# Altium schematic sheet MCU_CAN.SchDoc
size C
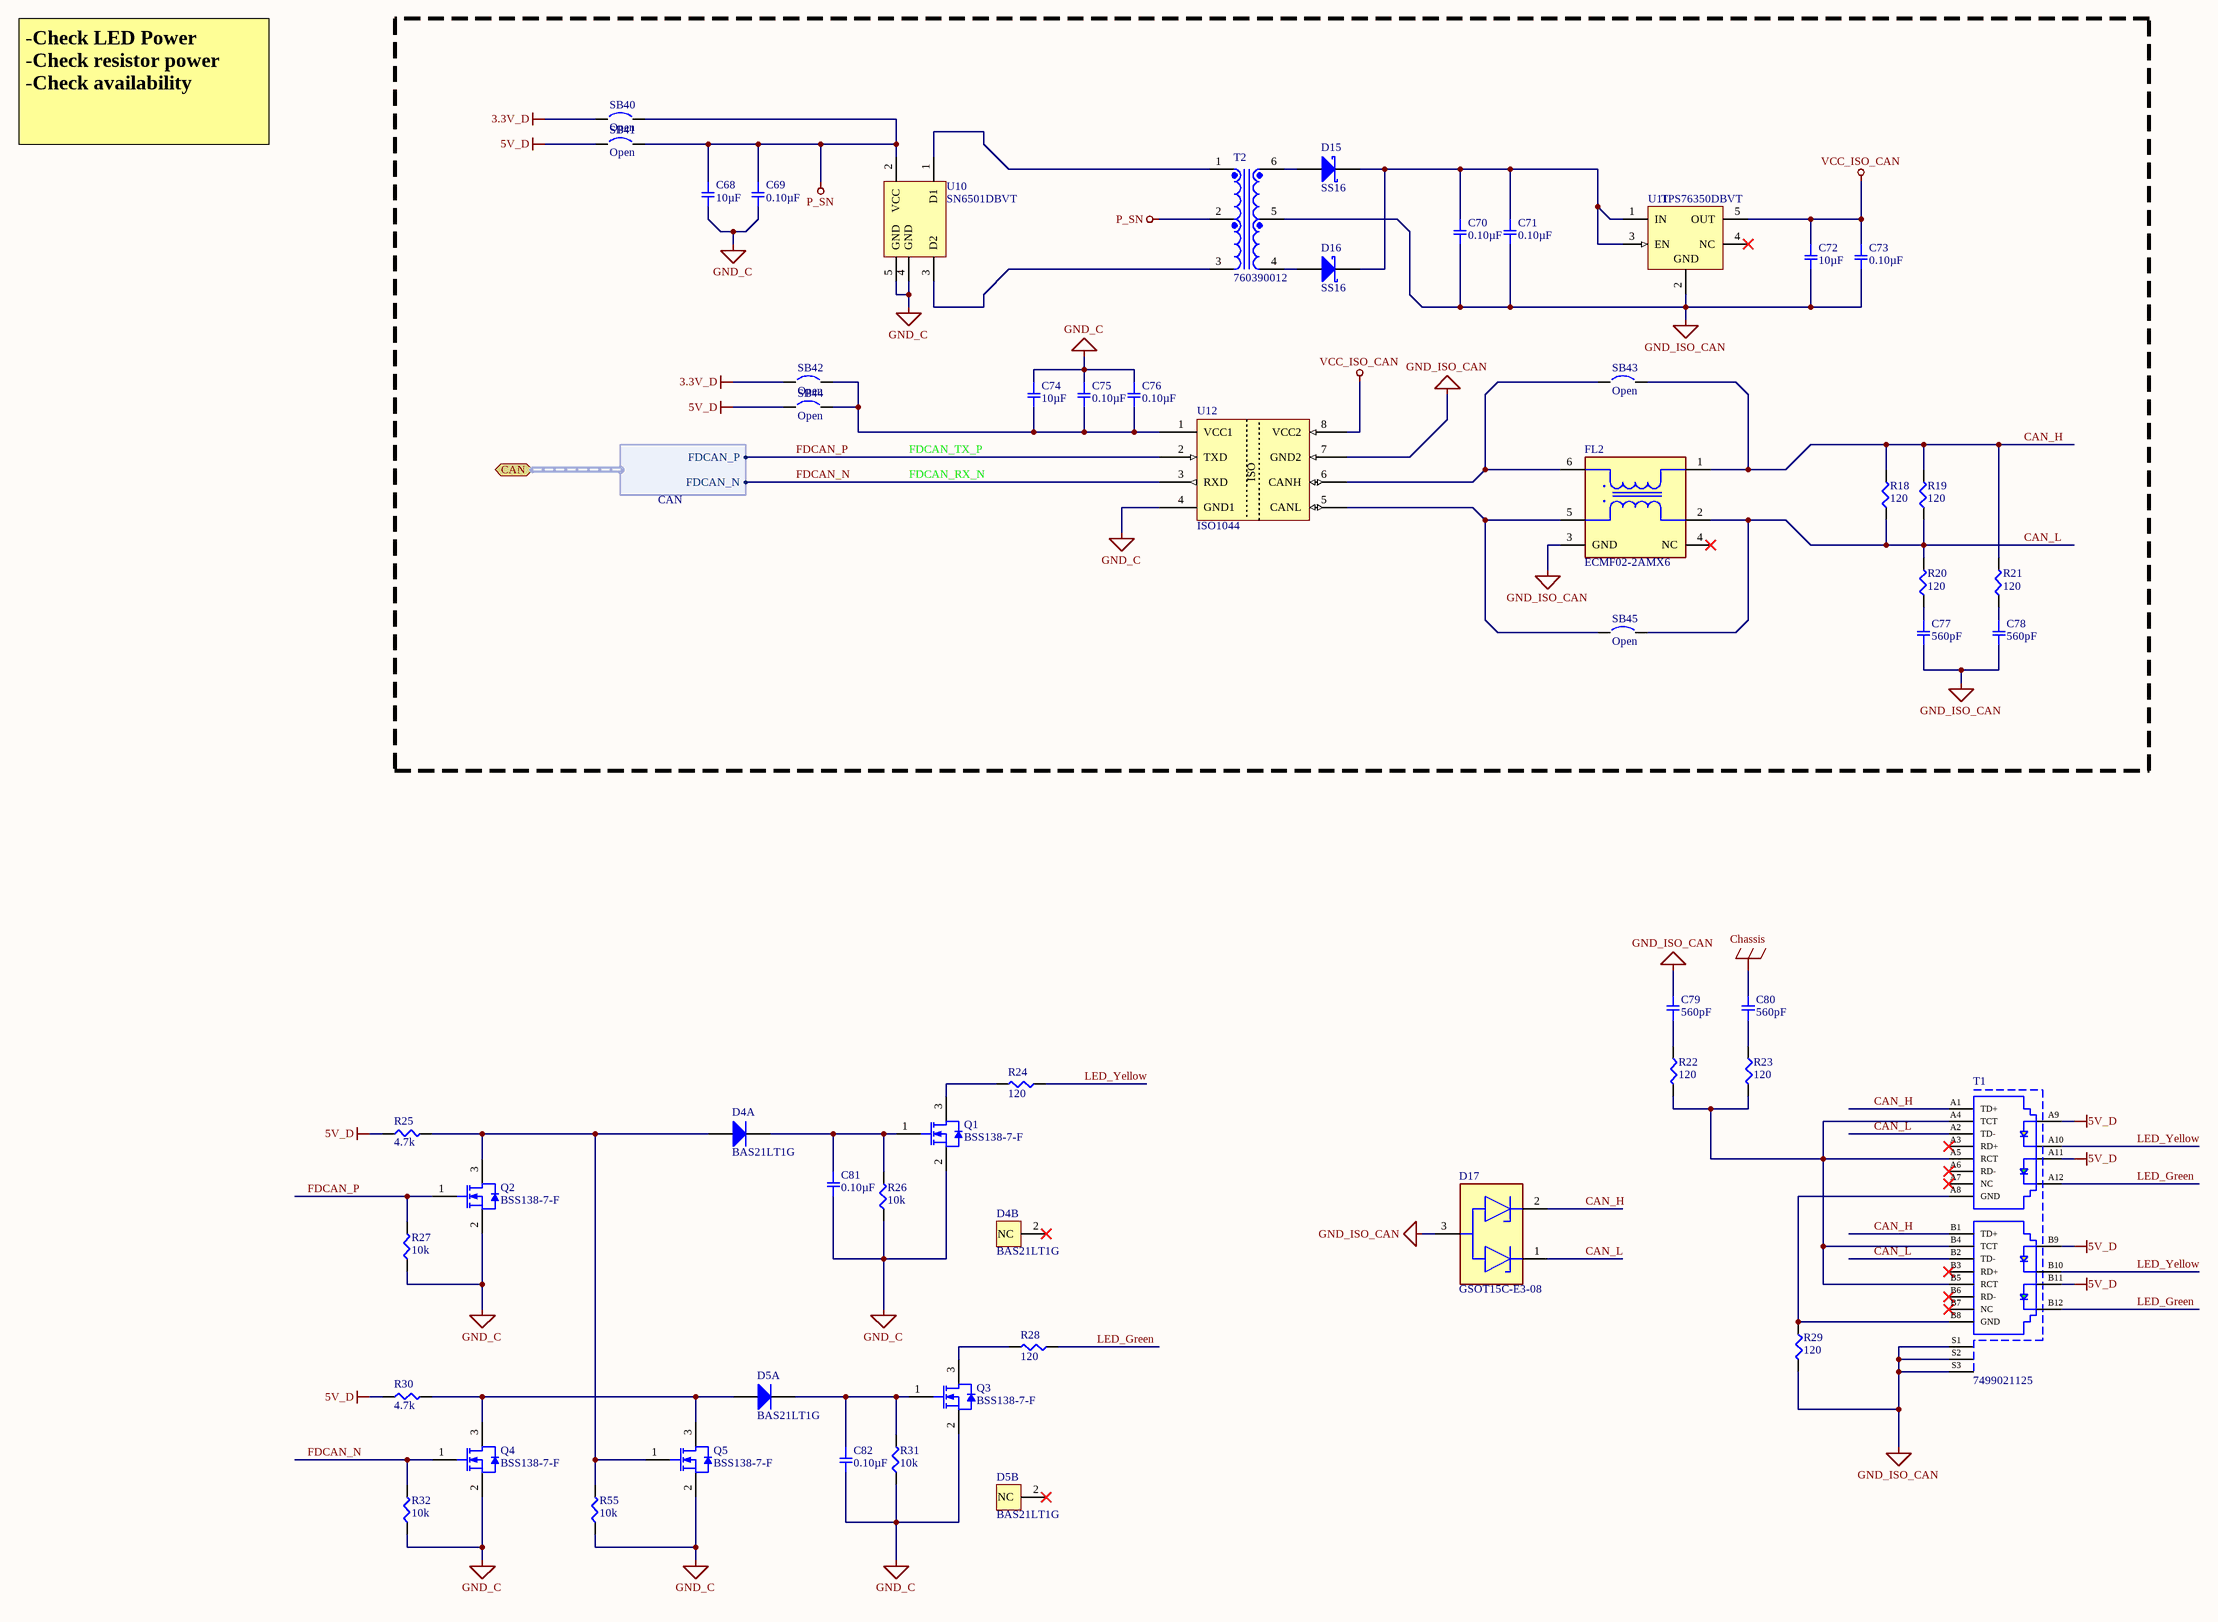
[diagram p0: MCU_CAN.SchDoc]

## Parts
C68  10µF  [SMD-0805C]
C69  0.10µF  [SMD-0805C]
C70  0.10µF  [SMD-0805C]
C71  0.10µF  [SMD-0805C]
C72  10µF  [SMD-0805C]
C73  0.10µF  [SMD-0805C]
C74  10µF  [SMD-0805C]
C75  0.10µF  [SMD-0805C]
C76  0.10µF  [SMD-0805C]
C77  560pF  [SMD-0805C]
C78  560pF  [SMD-0805C]
C79  560pF  [SMD-0805C]
C80  560pF  [SMD-0805C]
C81  0.10µF  [SMD-0805C]
C82  0.10µF  [SMD-0805C]
D4  BAS21LT1G  [ONSC-SOT-23-3-318-08_V]  (parts A,B of 2)
D5  BAS21LT1G  [ONSC-SOT-23-3-318-08_V]  (parts A,B of 2)
D15  SS16  [FAIR-SMA-2_B_V]
D16  SS16  [FAIR-SMA-2_B_V]
D17  GSOT15C-E3-08  [FP-6_541-5014_01-4-MFG]
FL2  ECMF02-2AMX6  [FP-QFN-6L-MFG]
Q1  BSS138-7-F  [DIOD-SOT23-3_V]
Q2  BSS138-7-F  [DIOD-SOT23-3_V]
Q3  BSS138-7-F  [DIOD-SOT23-3_V]
Q4  BSS138-7-F  [DIOD-SOT23-3_V]
Q5  BSS138-7-F  [DIOD-SOT23-3_V]
R18  120  [SMD-0603-RES]
R19  120  [SMD-0603-RES]
R20  120  [SMD-0603-RES]
R21  120  [SMD-0603-RES]
R22  120  [SMD-0603-RES]
R23  120  [SMD-0603-RES]
R24  120  [SMD-0603-RES]
R25  4.7k  [SMD-0603-RES]
R26  10k  [SMD-0603-RES]
R27  10k  [SMD-0603-RES]
R28  120  [SMD-0603-RES]
R29  120  [SMD-0603-RES]
R30  4.7k  [SMD-0603-RES]
R31  10k  [SMD-0603-RES]
R32  10k  [SMD-0603-RES]
R55  10k  [SMD-0603-RES]
SB40  Open  [SB_0603]  (no BOM)
SB41  Open  [SB_0603]  (no BOM)
SB42  Open  [SB_0603]  (no BOM)
SB43  Open  [SB_0603]  (no BOM)
SB44  Open  [SB_0603]  (no BOM)
SB45  Open  [SB_0603]  (no BOM)
T1  7499021125  [7499021125]
T2  760390012  [WE-760390012-6_V]
U10  SN6501DBVT  [SOT95P278X110-5N]
U11  TPS76350DBVT  [DBV0005A_M]
U12  ISO1044  [SOIC127P570X175_HS-9N - No Thermal]

## Ports
CAN (bidir, harness CAN)

## Harnesses
CAN: FDCAN_P, FDCAN_N

## Nets
3.3V_D: SB40.1 SB42.1
5V_D: R25.1 R30.1 SB41.1 SB44.1 T1.A9 T1.A11 T1.B9 T1.B11
Chassis: C80.2
GND_C: C68.2 C69.2 C74.1 C75.1 C76.1 C81.2 C82.2 Q1.2(S) Q2.2(S) Q3.2(S) Q4.2(S) Q5.2(S) R26.1 R27.1 R31.1 R32.1 R55.1 U10.4(GND) U10.5(GND) U12.4(GND1)
GND_ISO_CAN: C70.2 C71.2 C72.2 C73.2 C77.2 C78.2 C79.2 D17.3(COMMON_ANODE) FL2.3(GND) R29.2 T1.S1(Shield) T1.S2(Shield) T1.S3(Shield) T2.5 U11.2(GND) U12.7(GND2)
P_SN: C68.1 C69.1 SB40.2 SB41.2 T2.2 U10.2(VCC)
VCC_ISO_CAN: C72.1 C73.1 U11.5(OUT) U12.8(VCC2)
CAN_H: D17.2(2_CATHODE) FL2.1(D+) R18.2 R19.2 R21.2 SB43.2 T1.A1(TD+) T1.B1(TD+)
CAN_L: D17.1(1_CATHODE) FL2.2(D-) R18.1 R19.1 R20.2 SB45.2 T1.A2(TD-) T1.B2(TD-)
FDCAN_N: Q4.1(G) R32.2 U12.3(RXD) ; port CAN.FDCAN_N
FDCAN_P: Q2.1(G) R27.2 U12.2(TXD) ; port CAN.FDCAN_P
LED_Green: R28.1 T1.A12 T1.B12
LED_Yellow: R24.1 T1.A10 T1.B10
NetC70_1: C70.1 C71.1 D15.2(K) D16.2(K) U11.1(IN) U11.3(EN)
NetC74_2: C74.2 C75.2 C76.2 SB42.2 SB44.2 U12.1(VCC1)
NetC77_1: C77.1 R20.1
NetC78_1: C78.1 R21.1
NetC79_1: C79.1 R22.1
NetC80_1: C80.1 R23.1
NetC81_1: C81.1 D4.3(K) Q1.1(G) R26.2
NetC82_1: C82.1 D5.3(K) Q3.1(G) R31.2
NetD4_1: D4.1(A) Q2.3(D) Q5.1(G) R25.2 R55.2
NetD5_1: D5.1(A) Q4.3(D) Q5.3(D) R30.2
NetD15_1: D15.1(A) T2.6
NetD16_1: D16.1(A) T2.4
NetFL2_5: FL2.5(D-) SB45.1 U12.5(CANL)
NetFL2_6: FL2.6(D+) SB43.1 U12.6(CANH)
NetQ1_3: Q1.3(D) R24.2
NetQ3_3: Q3.3(D) R28.2
NetR22_2: R22.2 R23.2 T1.A4(TCT) T1.A5(RCT) T1.B4(TCT) T1.B5(RCT)
NetR29_1: R29.1 T1.A8(GND) T1.B8(GND)
NetT2_1: T2.1 U10.1(D1)
NetT2_3: T2.3 U10.3(D2)

Not connected (* = marked no-connect by the designer): D4 2(NC)*; D5 2(NC)*; FL2 4(NC)*; T1 A3(RD+)* A6(RD-)* A7(NC)* B3(RD+)* B6(RD-)* B7(NC)*; U11 4(NC)*

## Notes on the sheet
- -Check LED Power                                 -Check resistor power                             -Check availability
- FDCAN_RX_N
- FDCAN_TX_P
- (in symbol ISO1044) ISO

## Library data of the parts
C68 C72 C74 = GCM21BR71A106KE22L: CAP CER 10UF 10V X7R 0805; Manufacturer: Murata Electronics North America; Factory Stock: 0; Unit Price (USD): 0.49; Minimum Quantity: 1; Tolerance: ±10%; Datasheets: http://www.murata.com/~/media/webrenewal/support/library/catalog/products/capacitor/mlcc/c03e.ashx; Image: //media.digikey.com/photos/Murata%20Photos/NCP,GCM%20SERIES%200805.jpg; Digi-Key Part Number: 490-10674-1-ND; Part Number: GCM21BR71A106KE22L; Quantity Available: 125344; @ qty: 0; Packaging: Cut Tape (CT); Series: GCM; Part Status: Active; Value: 10µF; Voltage: 10V; Temperature Coefficient: X7R; Operating Temperature: -55°C ~ 125°C; Features: -; Ratings: AEC-Q200; Applications: Automotive; Mounting Type: Surface Mount, MLCC; Package / Case: 0805 (2012 Metric); Size / Dimension: 0.079" L x 0.049" W (2.00mm x 1.25mm); Height - Seated (Max): -; Thickness (Max): 0.055" (1.40mm); Lead Spacing: -; Lead Style: -
C69-C71 C73 C75 C76 C81 C82 = GCJ21BR72A104KA01L: CAP CER 0.1UF 100V X7R 0805; Manufacturer: Murata Electronics North America; Factory Stock: 0; Unit Price (USD): 0.32; Minimum Quantity: 1; Tolerance: ±10%; Datasheets: http://www.murata.com/~/media/webrenewal/support/library/catalog/products/capacitor/mlcc/c03e.ashx; Image: //media.digikey.com/Renders/Murata%20Renders/0805%20(2012%20Metric)%20.85mm.jpg; Digi-Key Part Number: 490-5825-1-ND; Part Number: GCJ21BR72A104KA01L; Quantity Available: 1873; @ qty: 0; Packaging: Cut Tape (CT); Series: GCJ; Part Status: Active; Value: 0.10µF; Voltage: 100V; Temperature Coefficient: X7R; Operating Temperature: -55°C ~ 125°C; Features: Soft Termination; Ratings: AEC-Q200; Applications: Automotive, Boardflex Sensitive; Mounting Type: Surface Mount, MLCC; Package / Case: 0805 (2012 Metric); Size / Dimension: 0.079" L x 0.049" W (2.00mm x 1.25mm); Height - Seated (Max): -; Thickness (Max): 0.049" (1.25mm); Lead Spacing: -; Lead Style: -
C77-C80 = GRM216R71H561KA01D: CAP CER 560PF 50V X7R 0805; Manufacturer: Murata Electronics North America; Factory Stock: 0; Unit Price (USD): 0.12; Minimum Quantity: 1; Tolerance: ±10%; Datasheets: http://www.murata.com/~/media/webrenewal/support/library/catalog/products/capacitor/mlcc/c02e.pdf; Image: //media.digikey.com/Renders/Murata%20Renders/0805%20(2012%20Metric)%20.85mm.jpg; Digi-Key Part Number: 490-11575-1-ND; Part Number: GRM216R71H561KA01D; Quantity Available: 7711; @ qty: 0; Packaging: Cut Tape (CT); Series: GRM; Part Status: Active; Value: 560pF; Voltage: 50V; Temperature Coefficient: X7R; Operating Temperature: -55°C ~ 125°C; Features: -; Ratings: -; Applications: General Purpose; Mounting Type: Surface Mount, MLCC; Package / Case: 0805 (2012 Metric); Size / Dimension: 0.079" L x 0.049" W (2.00mm x 1.25mm); Height - Seated (Max): -; Thickness (Max): 0.028" (0.70mm); Lead Spacing: -; Lead Style: -
D4 D5 = CMP-1679-00004-5: High Voltage Switching Diode, 250 V, 3-Pin SOT-23 (318-08), Pb-Free, Tape and Reel; Manufacturer: ON Semiconductor; ComponentLink1Description: Manufacturer URL; Mounting Technology: Surface Mount; ComponentLink2Description: Datasheet; PackageVersion: Rev. AP, 11/2009; ComponentLink3URL: http://www.onsemi.cn/pub_link/Collateral/318-08.PDF; Min Operating Temperature: -65 degC; DatasheetVersion: Rev. 16, 03/2014; RoHSCompliant: true; Max Operating Temperature: 150 degC; ComponentLink3Description: Package Specification; Packaging: Tape and Reel; Mount: Surface Mount; PackageDescription: 3-Pin Small Outline Transistor, Body 2.9 x 1.3 mm, Pitch 0.95 mm; PackageReference: SOT-23 (318-08); ComponentLink1URL: http://www.onsemi.com/; ComponentLink2URL: http://www.onsemi.com/pub_link/Collateral/BAS19LT1-D.PDF
D15 D16 = CMP-2000-07149-1: Schottky Rectifier, 700 mV, -65 to 125 degC, 2-Pin SMA, RoHS, Tape and Reel; Manufacturer: FairchildSemiconductor; Type: SchottkyDiode; Peak Average Forward Current: 1@Ta=75CA; Peak Reverse Current: 200uA; Peak Non-Repetitive Surge Current: 40A; Configuration: Single; Peak Forward Voltage: 0.7V; Peak Reverse Repetitive Voltage: 60V; Package: 2DO-214AC; Datasheet URL: http://www.mouser.com/ds/2/149/SS16-196707.pdf; Package Description: 2-Pin Surface Mount Device, Body 4.375 x 2.725 mm; Packaging: Tape&Reel; Package Reference: SMA-2; Mounting: SurfaceMount; Operating Temperature: -65to125°C; Datasheet Version: Rev. 1.9, 01/2015; Mounting Technology: SurfaceMount; Category: Rectifier; Manufacturer URL: https://www.fairchildsemi.com/
D17 = CMP-02577-000002-1: TVS DIODE 15V 28.8V SOT23-3; Manufacturer: Vishay; Peak Pulse Power: 345W; Automotive Grade: Grade 0; Max Junction Temp: +150°C; Value: 35pF; Breakdown Voltage: 16.5V; Peak Pulse Current: 8A; Number Of Channels: 2; Clamping Voltage: 24.8V; Direction: Unidirectional; Category: Diode; Device Class L3: unset; ComponentLink2URL: http://www.vishay.com/docs/85824/gsot03c.pdf; Lead Free: Yes; Reverse Standoff Voltage: 15V; Mouser Description: GSOT15C Series 12.3 V 120 pF SMT Bi-Directional ESD Protection Diode - SOT-23; Height: 1.15mm; Temperature Range High: +150°C; Automotive: Yes; RoHS: TRUE; ComponentLink2Description: Datasheet; Capacitance: 35pF; Device Class L1: Circuit Protection; Manufacturer Part Number: GSOT15C-E3-08; Package: 6.541-5014.01-4; Octopart: https://octopart.com/gsot15c-e3-08-vishay-46467627; Device Class L2: TVS Diodes; Temperature: -55°C to +150°C; Temperature Range Low: -55°C; Digikey Description: TVS DIODE 15V 28.8V SOT23-3
FL2 = CMP-12075-000001-1: CMC 200MA 2LN SMD ESD; Manufacturer: STMicroelectronics; Standoff Height: 0mm; Max Junction Temp: +125°C; Series Resistance: 2.5Ω; Device Class L2: EMI / RFI Components; Device Class L1: Passive Components; Height: 0.55mm; Lead Free: Yes; Package: QFN-6L; Temperature Range Low: -55°C; Octopart: https://octopart.com/ecmf02-2amx6-stmicroelectronics-44353078; Mouser Description: TVS Diodes / ESD Suppressors ESD Mode Filter 6GHz USB 2.0 MIPI 8kV; Device Class L3: Common Mode Chokes; ComponentLink2URL: https://www.st.com/resource/en/datasheet/ecmf02-2amx6.pdf; Ipc Land Pattern Name: DFN170X150X50-6; ComponentLink2Description: Datasheet; Automotive: No; Temperature Range High: +125°C; Temperature: -55°C to +125°C; RoHS: TRUE; Digikey Description: CMC 200MA 2LN SMD ESD; Manufacturer Part Number: ECMF02-2AMX6; Category: Filter
Q1-Q5 = CMP-2000-04930-1: N-Channel Enhancement Mode Mosfet, 50 V, 0.2 A, -55 to 150 degC, 3-Pin SOT23, RoHS, Tape and Reel; Manufacturer: Diodes Inc; Brand: DiodesIncorporated; Unit Weight: 0.000282oz; Pd - Power Dissipation: 300mW; Id - Continuous Drain Current: 200mA; Rds On - Drain-Source Resistance: 3.5Ohms; Vgs - Gate-Source Voltage: 20V; Number of Channels: 1Channel; Vds - Drain-Source Breakdown Voltage: 50V; Transistor Type: 1N-Channel; Typical Turn-Off Delay Time: 20ns; Configuration: Single; Mounting Style: SMD/SMT; Height: 1mm; Package Description: 3-Pin Small Outline Transistor, Body 2.9 x 1.3 mm, Pitch 0.96 mm; Datasheet Version: Rev. 20-2, 11/2013; Minimum Operating Temperature: -55C; Package / Case: SOT-23-3; Channel Mode: Enhancement; Product: MOSFETSmallSignal; Packaging: Reel; Maximum Operating Temperature: +150C; Datasheet URL: https://datasheet.ciiva.com/8115/ds30144-8115344.pdf; Product Category: MOSFET; Width: 1.3mm; Technology: Si; Package Reference: SOT23-3; Manufacturer URL: http://www.diodes.com/; Transistor Polarity: N-Channel; Length: 2.9mm; Factory Pack Quantity: 3000; Series: BSS138; RoHS: True; Typical Turn-On Delay Time: 20ns
R18-R24 R28 R29 = ERJ-3EKF1200V: RES SMD 120 OHM 1% 1/10W 0603; Manufacturer: Panasonic Electronic Components; Factory Stock: 0; Unit Price (USD): 0.00379; @ qty: 1500; Minimum Quantity: 1; Power (Watts): 0.1W, 1/10W; Temperature Coefficient: ±100ppm/°C; Part Number: ERJ-3EKF1200V; Datasheets: http://industrial.panasonic.com/www-cgi/jvcr13pz.cgi?E+PZ+3+AOA0002+ERJ3EKF1200V+7+WW; Image: //media.digikey.com/Photos/Panasonic%20Photos/MFG_ERJ-P6W%20Series.jpg; Digi-Key Part Number: P120HCT-ND; Quantity Available: 84623; Packaging: Cut Tape (CT); Series: ERJ; Part Status: Active; Value: 120; Tolerance: ±1%; Composition: Thick Film; Features: Automotive AEC-Q200; Operating Temperature: -55°C ~ 155°C; Package / Case: 0603 (1608 Metric); Supplier Device Package: 0603; Size / Dimension: 0.063" L x 0.031" W (1.60mm x 0.80mm); Height - Seated (Max): 0.022" (0.55mm); Number of Terminations: 2; Failure Rate: -
R25 R30 = ERJ-3EKF4701V: RES SMD 4.7K OHM 1% 1/10W 0603; Manufacturer: Panasonic Electronic Components; Factory Stock: 0; Unit Price (USD): 0.00379; @ qty: 1500; Minimum Quantity: 1; Power (Watts): 0.1W, 1/10W; Temperature Coefficient: ±100ppm/°C; Part Number: ERJ-3EKF4701V; Datasheets: http://industrial.panasonic.com/www-cgi/jvcr13pz.cgi?E+PZ+3+AOA0002+ERJ3EKF4701V+7+WW; Image: //media.digikey.com/Photos/Panasonic%20Photos/MFG_ERJ-P6W%20Series.jpg; Digi-Key Part Number: P4.70KHCT-ND; Quantity Available: 999380; Packaging: Cut Tape (CT); Series: ERJ; Part Status: Active; Value: 4.7k; Tolerance: ±1%; Composition: Thick Film; Features: Automotive AEC-Q200; Operating Temperature: -55°C ~ 155°C; Package / Case: 0603 (1608 Metric); Supplier Device Package: 0603; Size / Dimension: 0.063" L x 0.031" W (1.60mm x 0.80mm); Height - Seated (Max): 0.022" (0.55mm); Number of Terminations: 2; Failure Rate: -
R26 R27 R31 R32 R55 = ERJ-3EKF1002V: RES SMD 10K OHM 1% 1/10W 0603; Manufacturer: Panasonic Electronic Components; Factory Stock: 0; Unit Price (USD): 0.00379; @ qty: 1500; Minimum Quantity: 1; Power (Watts): 0.1W, 1/10W; Temperature Coefficient: ±100ppm/°C; Part Number: ERJ-3EKF1002V; Datasheets: http://industrial.panasonic.com/www-cgi/jvcr13pz.cgi?E+PZ+3+AOA0002+ERJ3EKF1002V+7+WW; Image: //media.digikey.com/Photos/Panasonic%20Photos/MFG_ERJ-P6W%20Series.jpg; Digi-Key Part Number: P10.0KHCT-ND; Quantity Available: 6703141; Packaging: Cut Tape (CT); Series: ERJ; Part Status: Active; Value: 10k; Tolerance: ±1%; Composition: Thick Film; Features: Automotive AEC-Q200; Operating Temperature: -55°C ~ 155°C; Package / Case: 0603 (1608 Metric); Supplier Device Package: 0603; Size / Dimension: 0.063" L x 0.031" W (1.60mm x 0.80mm); Height - Seated (Max): 0.022" (0.55mm); Number of Terminations: 2; Failure Rate: -
SB40-SB45 = Solder Bridge: Circuit Breaker; Published: 24-Mar-1999; Revision: July-2002: Re-released for DXP Platform.; Publisher: Altium Limited
T1 = 7499021125: WE-RJ45 LAN Transformer, THT, 10/100 Base-T, Port 1x2, Tab Down; PoE: non-PoE; LED: yellow-green; USB: No; Shield Tabs: Yes; ComponentLink1Description: Manufacturer; ComponentLink1URL: http://www.we-online.de; ComponentLink2Description: Datasheet; ComponentLink2URL: https://katalog.we-online.com/pbs/datasheet/7499021125.pdf; Part Number: 7499021125; Published Date: July 2019; Publisher: Wurth Elektronik; Tab: Down; Port Number: 1x2; Data Rate: 10/100 Base-T; Operating Temperature: 0 to +70degC; Mounting Technology: THT; Packaging: Tube
T2 = 760039112: Transformer, 150 mA, -40 to 125 degC, 6-Pin SMD, RoHS, Tape and Reel; Manufacturer: Wuerth Elektronik; Mounting Technology: SurfaceMount; Manufacturer URL: https://www.we-online.com/; Datasheet Version: Rev. 6C, 06/2013; Datasheet URL: https://datasheet.ciiva.com/12335/760390012-221167-12335394.pdf; Package Description: 6-Pin Surface Mount Device, Body 7.14 x 6.73 mm, Pitch 2.54 mm; Package Reference: 7060390012-6
U10 = SN6501: Transformer Driver for Isolated Power Supplies, 0.15 to 0.35 A, 3 to 5.5 V, -40 to 125 degC, 5-Pin SOT-23 (DBV), Green (RoHS & no Sb/Br), Tape and Reel; Manufacturer: TexasInstruments; Package Version: 4073253-4/N, 12/2014; Minimum Input Voltage: 3V; Switching Frequency: 300to620kHz; Output Voltage: 0to11V; Number of Outputs: 1; Maximum Input Voltage: 5.5V; Maximum Output Current: 0.35A; Type: Non-Inverting|Inverting|StepUp|StepDown; Package: 5SOT-23; Package URL: http://www.ti.com/lit/ml/mpds018l/mpds018l.pdf; Category: DCtoDCConverter; Package Reference: DBV5; Datasheet Version: Rev. G, 09/2014; Packaging: Tape&Reel; Operating Temperature: -40to125°C; Manufacturer URL: http://www.ti.com/; Mounting: SurfaceMount; Rad Hard: No; Package Description: 5-Pin Small Outline Transistor, Body 2.9 x 1.6 mm, Pitch 0.95 mm; Datasheet URL: http://www.ti.com/lit/ds/symlink/sn6501.pdf; Mounting Technology: SurfaceMount
U11 = CMP-0394-00604-2: Single Output LDO, 150 mA, Fixed 5 V Output, 2.7 to 10 V Input, with Low IQ, 5-pin SOT-23 (DBV), -40 to 125 degC, Green (RoHS & no Sb/Br); Manufacturer: Texas Instruments; Accuracy(%): 3; Iout(Max)(A): 0.15; Vin(Min)(V): 2.7; SubFamily: Single Channel LDO; Iq(Typ)(mA): 0.08; Vin(Max)(V): 10; Vout Adj(Min)(V): 5; Vdo(Typ)(mV): 300; PartNumber: TPS76350DBVT; Mounting Technology: Surface Mount; PackageDescription: 5-Pin Plastic Small Outline, Body 1.60 Ãƒâ€” 2.90 mm, Pitch 0.95 mm; ComponentLink2Description: Datasheet; ComponentLink2URL: http://www.ti.com/general/docs/lit/getliterature.tsp?genericPartNumber=TPS76350&fileType=pdf; Code_JEDEC: MO-178; PackageReference: DBV0005A; ComponentLink1Description: Manufacturer URL; Eco-Plan: Green (RoHS & no Sb/Br); ComponentLink3URL: http://www.ti.com/litv/pdf/mpds018i; Fixed Output Options(V): 5; ComponentLink1URL: http://www.ti.com/; DatasheetVersion: SLVS181H; ComponentLink3Description: Package Specification; Vout Adj(Max)(V): 5; PackageVersion: 4073253-4/K
U12 = ISO1044: Isolated FD CAN Transreciever